# Altium schematic sheet 24Vreg.SchDoc
size A
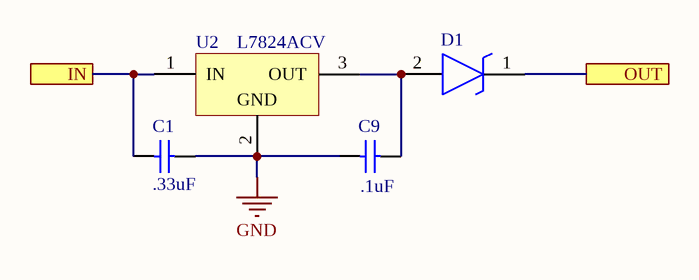
[diagram p0: 24Vreg.SchDoc]

## Parts
C1  .33uF  [CAPC2013X140X50ML20T25]
C9  .1uF  [CAPC2013X135X45ML10T25]
D1  PMEG3020DEP,115  [PMEG3050EP115]  (value not drawn)
U2  L7824ACV  [TO220]

## Ports
IN, OUT

## Nets
GND: C1.2 C9.1 U2.2(GND)
IN: C1.1 U2.1(IN) ; port IN
OUT: D1.1(K) ; port OUT
NetC9_2: C9.2 D1.2(A) U2.3(OUT)

## Library data of the parts
C1 = CMP-2007-04618-1: Manufacturer: AVX Interconnect / Elco; Part Number: 08053G334ZAT2A
C9 = CMP-2100-03644-1: Chip Capacitor, 0.1 uF, +/- 10%, 50 V, -55 to 125 degC, 0805 (2012 Metric), RoHS, Tape and Reel; Manufacturer: Murata; Voltage: 50V; Capacitance: 100nF; Insulation Resistance: 10GR; Dielectric Material: Ceramic; Dielectric: X7R; Package Description: 2-Pin Surface Mount Device, Body 2 x 1.25 mm; Manufacturer URL: http://www.murata.com/; Case Code (Imperial): 0805; Datasheet URL: http://psearch.en.murata.com/capacitor/product/GRM21BR71H104KA01%23.pdf; Termination: SMD/SMT; Lead Free: LeadFree; Package Quantity: 1; Mount: SurfaceMount; REACH SVHC: Unknown; Thickness: 0.053inch; Height: 1.25mm; Case/Package: 0805; Voltage Rating: 50V; Width: 0.049inch; Case Code (Metric): 2012; Material: Ceramic; Min Operating Temperature: -55degC; RoHSCompliant: true; Datasheet Version: 42675.0; Voltage Rating (DC): 50V; Tolerance: 10%; Package Reference: 0805; Depth: 1.25mm; Length: 2mm; Max Operating Temperature: 125degC; Packaging: TapeandReel; Number of Pins: 2; Radiation Hardening: No
D1 = PMEG3020DEP,115: Schottky Diode; Manufacturer_Name: Nexperia; Datasheet Link: https://assets.nexperia.com/documents/data-sheet/PMEG3020DEP.pdf; Height: 1mm; Manufacturer_Part_Number: PMEG3020DEP,115; Mouser Part Number: 771-PMEG3020DEP115; Mouser Price/Stock: https://www.mouser.com/Search/Refine.aspx?Keyword=771-PMEG3020DEP115; RS Part Number: 1513202; RS Price/Stock: https://uk.rs-online.com/web/p/products/1513202
U2 = CMP-0244-00465-1: Positive Voltage Regulator, 24V, 3-Pin TO-220; ComponentLink3Description: Package Specification; PackageReference: TO220; ComponentLink1Description: Manufacturer URL; PackageDescription: TO, Thru-Hole, Vertical, Heatsink Mounted; 3 In-Line Leads; Pitch 2.54 mm; ComponentLink1URL: http://www.st.com; DatasheetVersion: 16/11/2011; ComponentLink3URL: http://www.st.com/internet/com/TECHNICAL_RESOURCES/TECHNICAL_LITERATURE/PACKAGE_INFORMATION/CD00004649.pdf; ComponentLink2Description: Datasheet; ComponentLink2URL: http://www.st.com/internet/com/TECHNICAL_RESOURCES/TECHNICAL_LITERATURE/DATASHEET/CD00000444.pdf; PackageVersion: ver3.0